# EAGLE design PIC EEPROM (EAGLE 6.0)
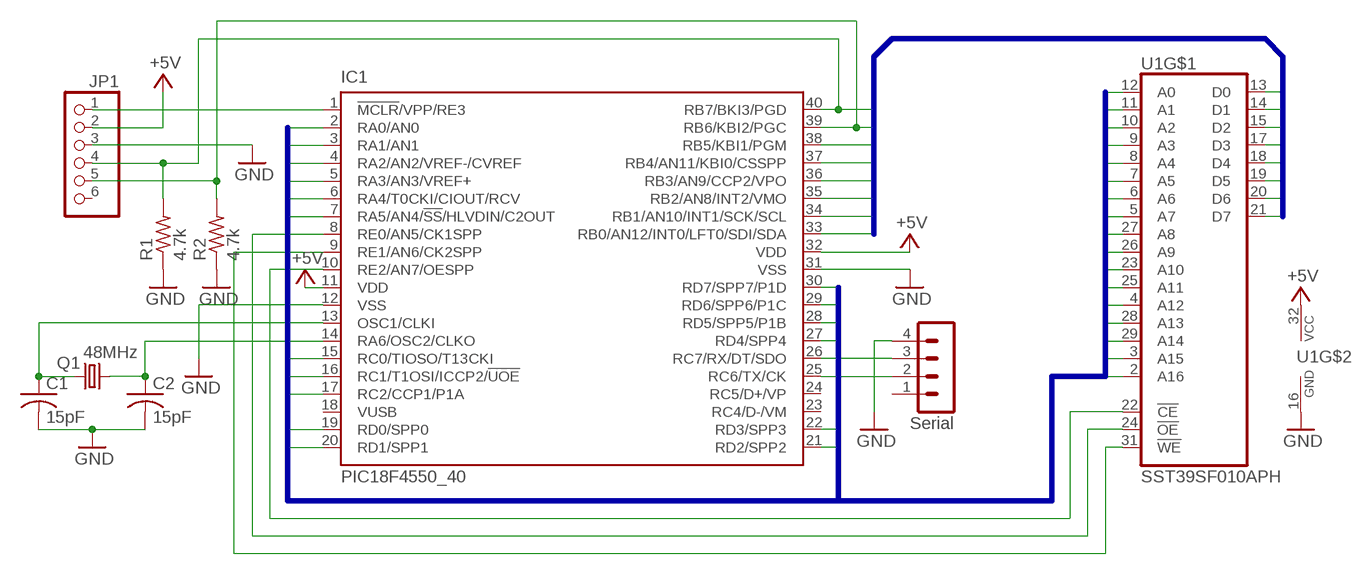
[diagram p0: schematic, sheet 1]

## Parts
C1  15pF  C-USC0603  [C0603]
C2  15pF  C-USC0603  [C0603]
IC1  PIC18F4550_40  [DIL40]
JP1  ICSP  PINHD-1X6/90  [1X06/90]
Q1  48MHz  CRYSTALHC49U-V  [HC49U-V]
R1  4.7k  R-US_R0603  [R0603]
R2  4.7k  R-US_R0603  [R0603]
SV1  Serial  MA04-1  [MA04-1]
U1  SST39SF010APH  [PDIP32]

## Nets
+5V: IC1.11(VDD) IC1.32(VDD) JP1.2 U1.32(VCC)
A0: IC1.19(RD0/SPP0) U1.12(A0)
A1: IC1.20(RD1/SPP1) U1.11(A1)
A2: IC1.21(RD2/SPP2) U1.10(A2)
A3: IC1.22(RD3/SPP3) U1.9(A3)
A4: IC1.27(RD4/SPP4) U1.8(A4)
A5: IC1.28(RD5/SPP5/P1B) U1.7(A5)
A6: IC1.29(RD6/SPP6/P1C) U1.6(A6)
A7: IC1.30(RD7/SPP7/P1D) U1.5(A7)
A8: IC1.2(RA0/AN0) U1.27(A8)
A9: IC1.3(RA1/AN1) U1.26(A9)
A10: IC1.4(RA2/AN2/VREF-/CVREF) U1.23(A10)
A11: IC1.5(RA3/AN3/VREF+) U1.25(A11)
A12: IC1.6(RA4/T0CKI/CIOUT/RCV) U1.4(A12)
A13: IC1.7(RA5/AN4/!SS!/HLVDIN/C2OUT) U1.28(A13)
A14: IC1.15(RC0/TIOSO/T13CKI) U1.29(A14)
A15: IC1.16(RC1/T1OSI/ICCP2/!UOE) U1.3(A15)
A16: IC1.17(RC2/CCP1/P1A) U1.2(A16)
D0: IC1.33(RB0/AN12/INT0/LFT0/SDI/SDA) U1.13(D0)
D1: IC1.34(RB1/AN10/INT1/SCK/SCL) U1.14(D1)
D2: IC1.35(RB2/AN8/INT2/VMO) U1.15(D2)
D3: IC1.36(RB3/AN9/CCP2/VPO) U1.17(D3)
D4: IC1.37(RB4/AN11/KBI0/CSSPP) U1.18(D4)
D5: IC1.38(RB5/KBI1/PGM) U1.19(D5)
D6: IC1.39(RB6/KBI2/PGC) JP1.5 R2.2 U1.20(D6)
D7: IC1.40(RB7/BKI3/PGD) JP1.4 R1.2 U1.21(D7)
GND: C1.2 C2.2 IC1.12(VSS) IC1.31(VSS) JP1.3 R1.1 R2.1 SV1.4 U1.16(GND)
N$1: IC1.1(!MCLR!/VPP/RE3) JP1.1
N$2: C1.1 IC1.13(OSC1/CLKI) Q1.1
N$3: IC1.10(RE2/AN7/OESPP) U1.22(!CE)
N$4: IC1.8(RE0/AN5/CK1SPP) U1.24(!OE)
N$5: IC1.9(RE1/AN6/CK2SPP) U1.31(!WE)
N$6: C2.1 IC1.14(RA6/OSC2/CLKO) Q1.2
N$8: IC1.25(RC6/TX/CK) SV1.2
N$9: IC1.26(RC7/RX/DT/SDO) SV1.3
Unconnected: IC1.18(VUSB) IC1.23(RC4/D-/VM) IC1.24(RC5/D+/VP) JP1.6 SV1.1

## Buses
D[0..7]
A[0..16]

## Library data of the parts
C1 C2 = rcl:C-US: CAPACITOR, American symbol
IC1 = microchip:PIC18F4*_40: USB Microcontrollers with nanoWatt Technology High-Performance, Enhanced Flash, 28/40/44-Pin, Source: http://ww1.microchip.com/downloads/en/devicedoc/39632c.pdf; MF: MICROCHIP; MPN: PIC18F4550-I/P; OC_FARNELL: 9321357; OC_NEWARK: 74K8623
JP1 = pinhead:PINHD-1X6: PIN HEADER
Q1 = crystal:CRYSTAL: CRYSTAL; OC_FARNELL: 1666969; OC_NEWARK: unknown
R1 R2 = resistor:R-US_: RESISTOR, American symbol
SV1 = con-lstb:MA04-1: PIN HEADER; OC_FARNELL: unknown; OC_NEWARK: unknown
U1 = Custom:SST39SF010A

## Board
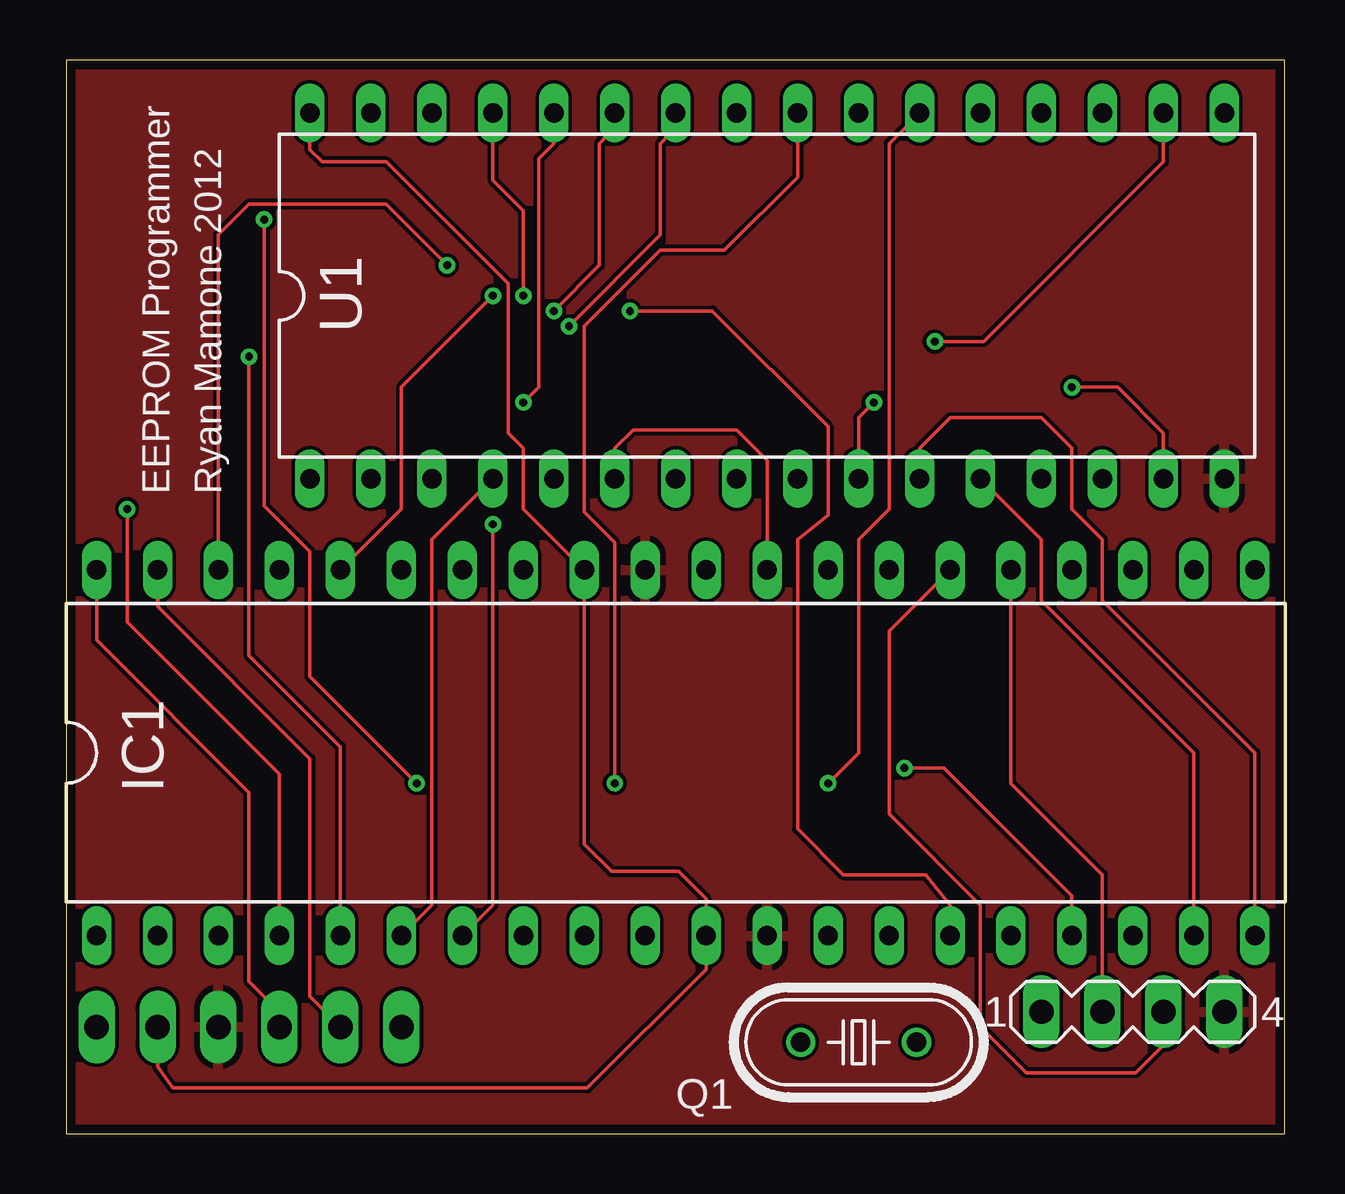
[diagram p1: board, top side]
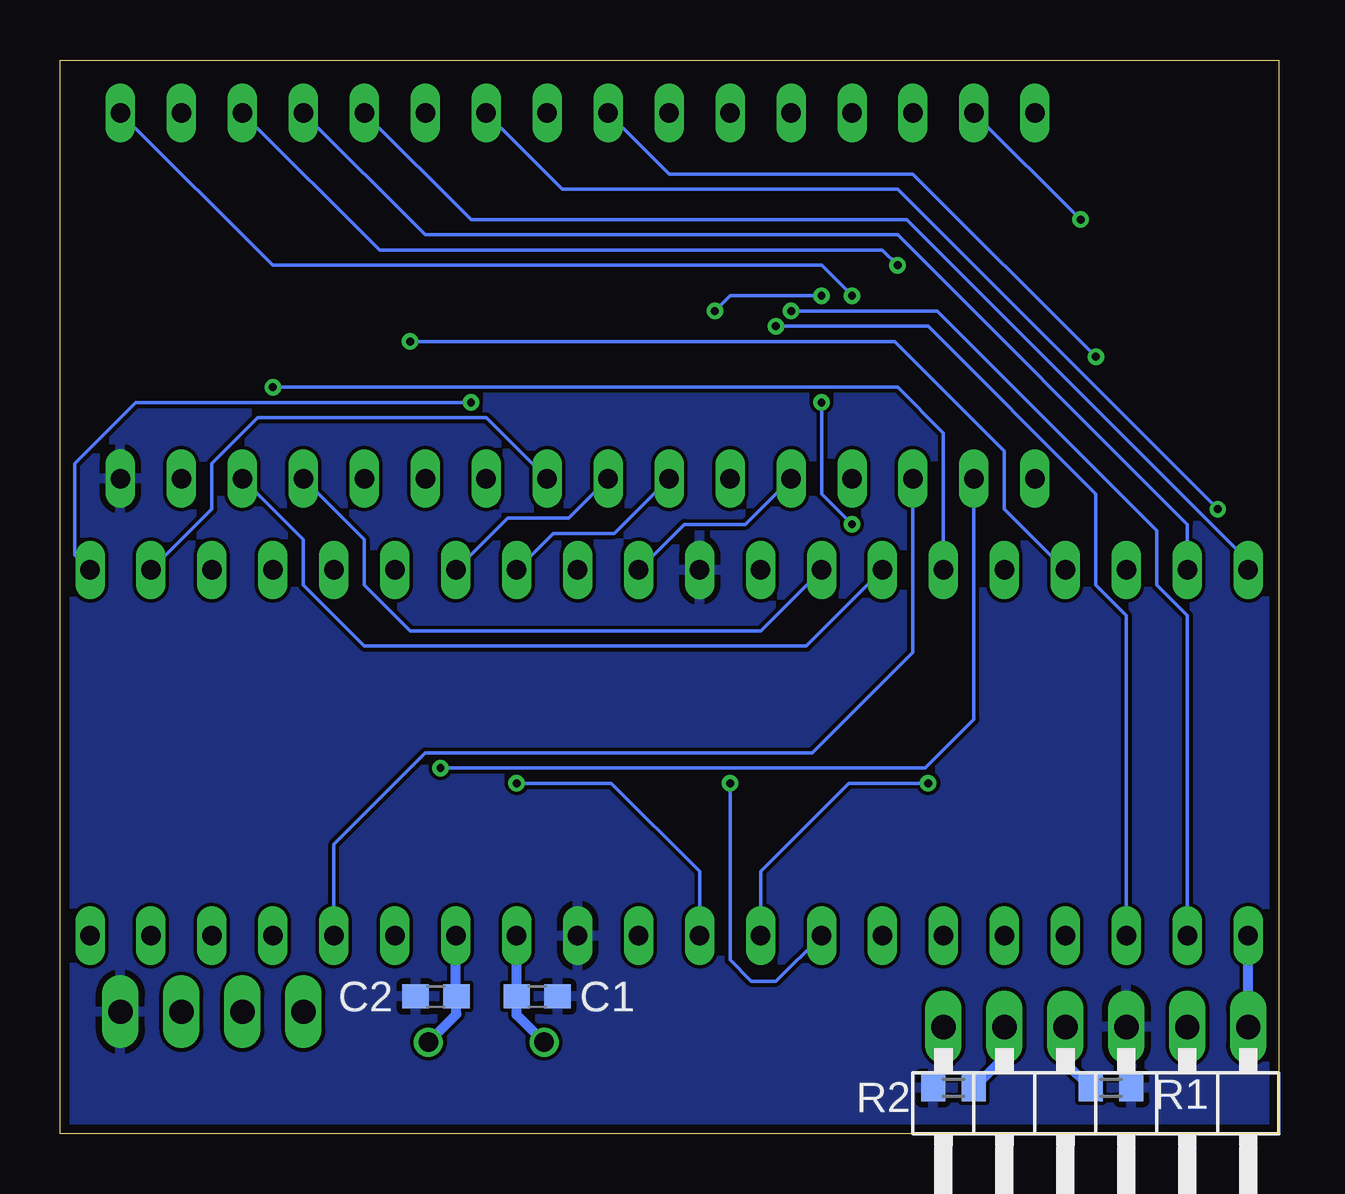
[diagram p2: board, bottom side, seen from below]

Size 50.78 x 44.76 mm. Coordinates in mm from the lower left corner, seen from the top.
Outline: 0,0 50.78,0 50.78,44.76 0,44.76 0,0
Copper layers (1*16): Top 0.0356mm / dielectric 1.5011mm / Bottom 0.0356mm
Design rules: minimum track width 6mil, minimum drill 13mil, track to track 6mil, track to pad 6mil, pad to pad 6mil, via to via 6mil, smd to smd 6mil, copper to edge 15mil, drill to drill 6mil, minimum pad ring 7mil, minimum via ring 7mil, stop-mask expansion 4mil, vias tented up to drill 0mil, thermal gap 10mil

### Footprints (pad centres in the part's own frame; a part is rotated, then mirrored left to right if it is on the bottom)
C0603 = smd 1.1 x 1: 1 -0.85,0; 2 0.85,0
DIL40 = drill 0.813 long: 1 -24.13,-7.62; 2 -21.59,-7.62; 3 -19.05,-7.62; 4 -16.51,-7.62; 5 -13.97,-7.62; 6 -11.43,-7.62; 7 -8.89,-7.62; 8 -6.35,-7.62; 9 -3.81,-7.62; 10 -1.27,-7.62; 11 1.27,-7.62; 12 3.81,-7.62; 13 6.35,-7.62; 14 8.89,-7.62; 15 11.43,-7.62; 16 13.97,-7.62; 17 16.51,-7.62; 18 19.05,-7.62; 19 21.59,-7.62; 20 24.13,-7.62; 21 24.13,7.62; 22 21.59,7.62; 23 19.05,7.62; 24 16.51,7.62; 25 13.97,7.62; 26 11.43,7.62; 27 8.89,7.62; 28 6.35,7.62; 29 3.81,7.62; 30 1.27,7.62; 31 -1.27,7.62; 32 -3.81,7.62; 33 -6.35,7.62; 34 -8.89,7.62; 35 -11.43,7.62; 36 -13.97,7.62; 37 -16.51,7.62; 38 -19.05,7.62; 39 -21.59,7.62; 40 -24.13,7.62
1X06/90 = drill 1.016 long: 1 -6.35,-3.81; 2 -3.81,-3.81; 3 -1.27,-3.81; 4 1.27,-3.81; 5 3.81,-3.81; 6 6.35,-3.81
HC49U-V = drill 0.813: 1 -2.413,0; 2 2.413,0
R0603 = smd 1 x 1.1: 1 -0.85,0; 2 0.85,0
MA04-1 = drill 1.016 long: 1 -3.81,0; 2 -1.27,0; 3 1.27,0; 4 3.81,0
PDIP32 = drill 0.813 long: 1 -17.78,-7.62; 2 -15.24,-7.62; 3 -12.7,-7.62; 4 -10.16,-7.62; 5 -7.62,-7.62; 6 -5.08,-7.62; 7 -2.54,-7.62; 8 0,-7.62; 9 2.54,-7.62; 10 5.08,-7.62; 11 7.62,-7.62; 12 10.16,-7.62; 13 12.7,-7.62; 14 15.24,-7.62; 15 17.78,-7.62; 16 20.32,-7.62; 17 20.32,7.62; 18 17.78,7.62; 19 15.24,7.62; 20 12.7,7.62; 21 10.16,7.62; 22 7.62,7.62; 23 5.08,7.62; 24 2.54,7.62; 25 0,7.62; 26 -2.54,7.62; 27 -5.08,7.62; 28 -7.62,7.62; 29 -10.16,7.62; 30 -12.7,7.62; 31 -15.24,7.62; 32 -17.78,7.62

### Placement (x,y rotation side)
C1  30.9,5.71 0 bottom
C2  35.12,5.71 180 bottom
IC1  25.4,15.88 0 top
JP1  7.62,0.64 180 bottom
Q1  33.02,3.81 0 top
R1  6.99,1.91 180 bottom
R2  13.55,1.91 0 bottom
SV1  44.45,5.08 0 top
U1  27.94,34.92 0 top

### Tracks (layer width: path | path; a pad name or v marks a point on that pad's centre or on a via)
+5V
  Top 0.152: U1.32 10.16,41.02 10.67,40.51 13.34,40.51 18.41,35.43 18.41,29.21 19.05,28.57 19.05,26.04 IC1.32 21.59,12.06 22.73,10.92 25.53,10.92 26.67,9.78 IC1.11 26.67,6.86 21.72,1.91 4.45,1.91 3.81,2.79 JP1.2
A0
  Top 0.152: IC1.19 46.99,15.88 40.64,22.23 40.64,24.77 U1.12
A1
  Top 0.152: IC1.20 49.53,15.88 43.18,22.23 43.18,24.77 41.91,26.04 41.91,28.57 40.64,29.84 36.83,29.84 35.56,28.57 U1.11
A2  (via drill 0.33)
  Top 0.152: U1.10 33.02,29.84 v33.66,30.48
  Bottom 0.152: v33.66,30.48 47.62,30.48 50.16,27.94 50.16,24.13 IC1.21
A3
  Bottom 0.152: U1.9 33.02,29.84 42.55,29.84 44.45,27.94 44.45,26.04 IC1.22
A4
  Bottom 0.152: U1.8 29.59,25.65 32.13,25.65 IC1.27
A5
  Bottom 0.152: U1.7 27.69,25.02 30.23,25.02 IC1.28
A6
  Top 0.152: U1.6 22.86,28.57 23.62,29.34 27.94,29.34 29.21,28.07 IC1.29
A7
  Bottom 0.152: U1.5 22.23,25.4 24.77,25.4 IC1.30
A8  (via drill 0.33)
  Top 0.152: v20.32,34.29 22.23,36.2 22.23,41.27 22.86,41.91 U1.27
  Bottom 0.152: IC1.2 3.81,21.59 5.08,22.86 5.08,25.15 14.22,34.29 v20.32,34.29
A9  (via drill 0.33)
  Top 0.152: v20.95,33.66 24.77,37.47 24.77,41.27 25.4,41.91 U1.26
  Bottom 0.152: IC1.3 6.35,21.59 7.62,22.86 7.62,26.67 14.61,33.66 v20.95,33.66
A10  (via drill 0.33)
  Top 0.152: IC1.4 8.89,14.99 2.54,21.34 v2.54,26.04
  Bottom 0.152: v2.54,26.04 15.88,39.37 29.84,39.37 U1.23
A11  (via drill 0.33)
  Top 0.152: IC1.5 11.43,16.13 7.62,19.94 v7.62,32.38
  Bottom 0.152: v7.62,32.38 15.24,40.01 25.4,40.01 U1.25
A12
  Top 0.152: IC1.6 15.24,9.53 15.24,24.77 U1.4
A13  (via drill 0.33)
  Top 0.152: IC1.7 17.78,9.53 v17.78,25.4 | v19.05,30.48 19.68,31.11 19.68,40.64 20.32,41.27 U1.28
  Bottom 0.152: v17.78,25.4 19.05,26.67 v19.05,30.48
A14  (via drill 0.33)
  Top 0.152: IC1.15 36.83,9.53 35.81,10.79 32.38,10.79 30.48,12.7 30.48,24.77 31.75,25.78 31.75,29.46 26.92,34.29 v23.5,34.29 | v19.05,34.92 19.05,38.48 17.78,39.75 U1.29
  Bottom 0.152: v23.5,34.29 22.86,34.92 v19.05,34.92
A15
  Bottom 0.152: U1.3 15.24,20.07 19.43,15.88 35.56,15.88 39.37,12.06 IC1.16
A16  (via drill 0.33)
  Top 0.152: IC1.17 41.91,9.91 36.58,15.24 v34.92,15.24
  Bottom 0.152: U1.2 12.7,17.27 14.73,15.24 v34.92,15.24
D0
  Bottom 0.152: IC1.33 21.59,20.95 36.2,20.95 38.1,22.86 38.1,24.77 U1.13
D1
  Bottom 0.152: IC1.34 19.68,20.32 38.1,20.32 40.64,22.86 40.64,24.77 U1.14
D2  (via drill 0.33)
  Top 0.152: U1.15 45.72,29.21 43.81,31.11 v41.91,31.11
  Bottom 0.152: IC1.35 13.97,29.21 15.88,31.11 v41.91,31.11
D3  (via drill 0.33)
  Top 0.152: IC1.36 13.97,26.04 13.97,31.11 v17.78,34.92
  Bottom 0.152: v17.78,34.92 19.05,36.2 41.91,36.2 U1.17
D4  (via drill 0.33)
  Top 0.152: U1.18 45.72,40.51 38.23,33.02 v36.2,33.02
  Bottom 0.152: IC1.37 11.43,26.04 11.43,28.45 16,33.02 v36.2,33.02
D5  (via drill 0.33)
  Top 0.152: IC1.38 6.35,37.47 7.62,38.73 13.34,38.73 v15.88,36.2
  Bottom 0.152: v15.88,36.2 16.51,36.83 37.47,36.83 U1.19
D6
  Top 0.152: JP1.5 10.16,5.71 10.16,15.62 3.81,21.97 IC1.39
  Bottom 0.152: R2.2 | U1.20 35.56,37.47 15.88,37.47 3.81,25.4 IC1.39
  Bottom 0.406: JP1.5 11.43,3.17 R2.2
D7
  Top 0.152: IC1.40 1.27,20.57 7.62,14.22 7.62,6.35 8.89,5.08 JP1.4
  Bottom 0.152: U1.21 33.66,38.1 15.49,38.1 1.27,23.88 IC1.40
  Bottom 0.406: JP1.4 8.89,2.96 R1.2
GND
  pour Top: 0,44.7 0,0 50.8,0 50.8,44.7
  pour Bottom: 0,44.7 0,0 50.8,0 50.8,44.7
N$1
  Bottom 0.406: JP1.1 IC1.1
N$2
  Bottom 0.406: Q1.1 31.75,4.95 C1.1 IC1.13
N$3  (via drill 0.33)
  Top 0.152: v31.75,14.61 33.02,15.88 33.02,24.77 34.29,26.04 34.29,41.27 U1.22
  Bottom 0.152: IC1.10 24.13,10.92 27.81,14.61 v31.75,14.61
N$4  (via drill 0.33)
  Top 0.152: v22.86,14.61 22.86,24.64 21.59,25.91 21.59,33.66 24.77,36.83 27.43,36.83 30.48,39.88 U1.24
  Bottom 0.152: IC1.8 20.95,6.35 21.97,6.35 22.86,7.24 v22.86,14.61
N$5  (via drill 0.33)
  Top 0.152: v14.61,14.61 10.16,19.05 10.16,24.26 8.26,26.16 v8.26,38.1
  Bottom 0.152: v14.61,14.61 17.91,14.61 21.59,10.92 IC1.9 | U1.31 v8.26,38.1
N$6
  Bottom 0.406: Q1.2 34.27,4.98 C2.1 34.29,5.74 IC1.14
N$8
  Top 0.152: IC1.25 39.37,14.61 43.18,10.79 SV1.2
N$9
  Top 0.152: IC1.26 34.29,20.95 34.29,13.34 38.1,9.53 38.1,4.45 40.01,2.54 44.58,2.54 45.72,3.68 SV1.3

### Text on the board
tPlace: EEPROM Programmer | Ryan Mamone 2012
tValues: TX | RX